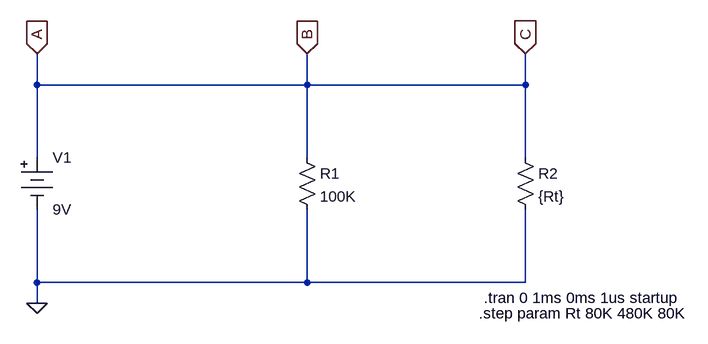
[diagram p0: schematic Draft1.asc]
Draft1.asc, the LTspice schematic file:
Version 4
SHEET 1 960 680
WIRE -48 144 -48 96
WIRE 368 144 368 96
WIRE 368 144 -48 144
WIRE 704 144 704 96
WIRE 704 144 368 144
WIRE -48 256 -48 144
WIRE 368 256 368 144
WIRE 704 256 704 144
WIRE -48 448 -48 336
WIRE 368 448 368 336
WIRE 368 448 -48 448
WIRE 704 448 704 336
WIRE 704 448 368 448
WIRE -48 480 -48 448
FLAG -48 96 A
IOPIN -48 96 In
FLAG 368 96 B
IOPIN 368 96 In
FLAG 704 96 C
IOPIN 704 96 In
FLAG -48 480 0
SYMBOL Misc/battery -48 240 R0
SYMATTR InstName V1
SYMATTR Value 9V
SYMBOL res 352 240 R0
SYMATTR InstName R1
SYMATTR Value 100K
SYMBOL res 688 240 R0
SYMATTR InstName R2
SYMATTR Value {Rt}
TEXT 632 496 Left 2 !.step param Rt 80K 480K 80K
TEXT 640 472 Left 2 !.tran 0 1ms 0ms 1us startup

The netlist it stands for:
* Draft1.asc
V1 C 0 9V
R1 C 0 100K
R2 C 0 {Rt}
.step param Rt 80K 480K 80K
.tran 0 1ms 0ms 1us startup
.backanno
.end